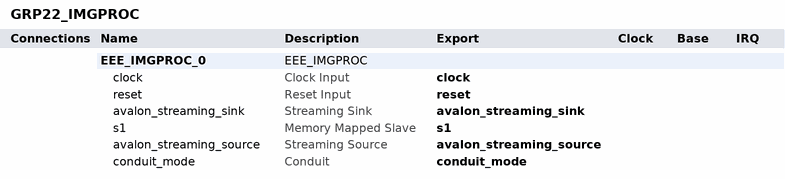
[diagram p0: system contents]
# Platform Designer (Qsys) system GRP22_IMGPROC, MAX 10 10M50DAF484C7G
# Parameters at their usual value, and those the tool derives, are not listed.
package require qsys
create_system GRP22_IMGPROC
set_project_property DEVICE_FAMILY {MAX 10}
set_project_property DEVICE 10M50DAF484C7G

add_instance EEE_IMGPROC_0 EEE_IMGPROC 1.0
set_instance_property EEE_IMGPROC_0 AUTO_EXPORT true

# exported interfaces
add_interface avalon_streaming_sink avalon_streaming sink
set_interface_property avalon_streaming_sink EXPORT_OF EEE_IMGPROC_0.avalon_streaming_sink
add_interface avalon_streaming_source avalon_streaming source
set_interface_property avalon_streaming_source EXPORT_OF EEE_IMGPROC_0.avalon_streaming_source
add_interface clock clock sink
set_interface_property clock EXPORT_OF EEE_IMGPROC_0.clock
add_interface conduit_mode conduit end
set_interface_property conduit_mode EXPORT_OF EEE_IMGPROC_0.conduit_mode
add_interface reset reset sink
set_interface_property reset EXPORT_OF EEE_IMGPROC_0.reset
add_interface s1 avalon slave
set_interface_property s1 EXPORT_OF EEE_IMGPROC_0.s1

set_interconnect_requirement {$system} qsys_mm.clockCrossingAdapter HANDSHAKE
set_interconnect_requirement {$system} qsys_mm.enableEccProtection FALSE
set_interconnect_requirement {$system} qsys_mm.insertDefaultSlave FALSE
set_interconnect_requirement {$system} qsys_mm.maxAdditionalLatency 1

save_system GRP22_IMGPROC.qsys
